# Altium schematic sheet Acquisition-System_V1.0_MCU.SchDoc: Acquisition-System
size A4; PageSetup: Record=PageOptions|CenterHorizontal=True|CenterVertical=True|PrintScale=0.97|XCorrection=1.00|YCorrection=1.00|PrintKind=0|BorderSize=5000000|LeftOffset=0|BottomOffset=0|Orientation=2|PaperLength=1000|PaperWidth=1000|Scale=100|PaperSource=7|PrintQuality=-3|MediaType=1|DitherType=10|PrintScaleMode=1|PaperKind=A4|PaperIndex=9; Organization: Ostschweizer Fachhochschule; Address2: Florian Baumgartner & Thierry Schwaller; Address3: florian.baumgartner@ost.ch; DocumentNumber: 4; Revision: V1.0; SheetNumber: 4; SheetTotal: 5; Author: Florian Baumgartner & Alain Keller; Subtitle: MCU
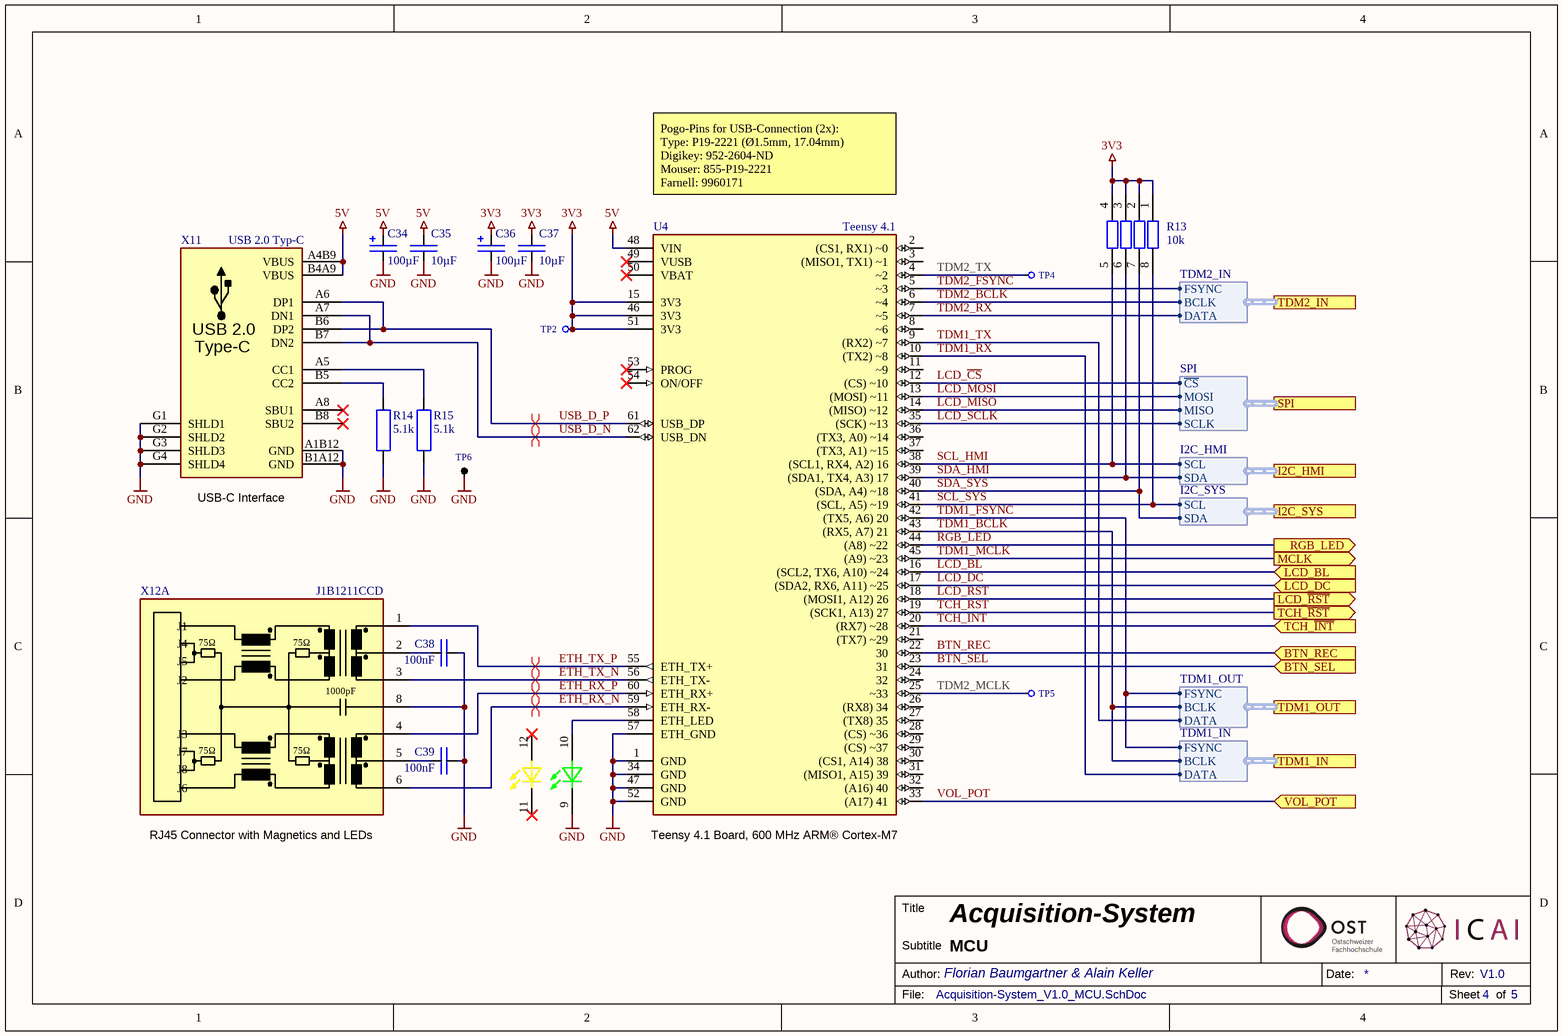
[diagram p0: Acquisition-System_V1.0_MCU.SchDoc]

## Parts
C34  100µF  [SMD Tantalkondensator 1210 +]
C35  10µF  [SMD Keramikkondensator 1206]
C36  100µF  [SMD Tantalkondensator 1210 +]
C37  10µF  [SMD Keramikkondensator 1206]
C38  100nF  [SMD Keramikkondensator 0603]
C39  100nF  [SMD Keramikkondensator 0603]
R13  10k  [SMD Widerstand Array 4-Fach 0603]
R14  5.1k  [SMD Widerstand 0603]
R15  5.1k  [SMD Widerstand 0603]
TP2  X-TP  [THT Testpunkt Ø1mm]  (value not drawn)  (no BOM)
TP4  X-TP  [THT Testpunkt Ø1mm]  (value not drawn)  (no BOM)
TP5  X-TP  [THT Testpunkt Ø1mm]  (value not drawn)  (no BOM)
TP6  Schwarz  [THT Messpunkt Ø2.54mm Schwarz]  (value not drawn)
U4  Teensy 4.1  [THT Teensy 4.1]
X11  USB 2.0 Typ-C  [SMD USB-C Socket (A40-00119)]
X12  J1B1211CCD  [THT RJ45 Socket (J1B1211CCD)]  (parts A,B of 2)

## Ports
BTN_REC (in), BTN_SEL (in), I2C_HMI (harness I2C_HMI), I2C_SYS (harness I2C_SYS), LCD_BL (in), LCD_DC (in), LCD_~{RST} (out), MCLK (out), RGB_LED (out), SPI (harness SPI), TCH_~{INT} (in), TCH_~{RST} (out), TDM1_IN (harness TDM1_IN), TDM1_OUT (harness TDM1_OUT), TDM2_IN (harness TDM2_IN), VOL_POT (in)

## Harnesses
I2C_HMI: SCL, SDA
TDM1_IN: BCLK, FSYNC, DATA
I2C_SYS: SCL, SDA
TDM2_IN: BCLK, FSYNC, DATA
TDM1_OUT: BCLK, FSYNC, DATA
SPI: SCLK, MOSI, ~{CS}, MISO

## Nets
3V3: C36.P(+) C37.2 R13.1 R13.2 R13.3 R13.4 TP2.1 U4.15(3V3) U4.46(3V3) U4.51(3V3)
5V: C34.P(+) C35.2 U4.48(VIN) X11.A4B9(VBUS) X11.B4A9(VBUS)
GND: C34.M(-) C35.1 C36.M(-) C37.1 C38.1 C39.1 R14.2 R15.2 TP6.1 U4.1(GND) U4.34(GND) U4.47(GND) U4.52(GND) U4.57(ETH_GND) X11.A1B12(GND) X11.B1A12(GND) X11.G1(SHLD1) X11.G2(SHLD2) X11.G3(SHLD3) X11.G4(SHLD4) X12.8(VC1-) X12.9(LEDYK)
BTN_REC: U4.22(30) ; port BTN_REC
BTN_SEL: U4.23(31) ; port BTN_SEL
ETH_RX_N: U4.59(ETH_RX-) X12.6(RD-)
ETH_RX_P: U4.60(ETH_RX+) X12.4(RD+)
ETH_TX_N: U4.56(ETH_TX-) X12.3(TD-)
ETH_TX_P: U4.55(ETH_TX+) X12.1(TD+)
LCD_BL: U4.16((SCL2,_TX6,_A10)_~24) ; port LCD_BL
LCD_~{CS}: U4.12((CS)_~10) ; port SPI.~{CS}
LCD_DC: U4.17((SDA2,_RX6,_A11)_~25) ; port LCD_DC
LCD_MISO: U4.14((MISO)_~12) ; port SPI.MISO
LCD_MOSI: U4.13((MOSI)_~11) ; port SPI.MOSI
LCD_~{RST}: U4.18((MOSI1,_A12)_26) ; port LCD_~{RST}
LCD_SCLK: U4.35((SCK)_~13) ; port SPI.SCLK
RGB_LED: U4.44((A8)_~22) ; port RGB_LED
SCL_HMI: R13.5 U4.38((SCL1,_RX4,_A2)_16) ; port I2C_HMI.SCL
SCL_SYS: R13.8 U4.41((SCL,_A5)_~19) ; port I2C_SYS.SCL
SDA_HMI: R13.6 U4.39((SDA1,_TX4,_A3)_17) ; port I2C_HMI.SDA
SDA_SYS: R13.7 U4.40((SDA,_A4)_~18) ; port I2C_SYS.SDA
TCH_~{INT}: U4.20((RX7)_~28) ; port TCH_~{INT}
TCH_~{RST}: U4.19((SCK1,_A13)_27) ; port TCH_~{RST}
TDM1_BCLK: U4.43((RX5,_A7)_21) ; port TDM1_IN.BCLK, port TDM1_OUT.BCLK
TDM1_FSYNC: U4.42((TX5,_A6)_20) ; port TDM1_IN.FSYNC, port TDM1_OUT.FSYNC
TDM1_MCLK: U4.45((A9)_~23) ; port MCLK
TDM1_RX: U4.10(NC) ; port TDM1_IN.DATA
TDM1_TX: U4.9(NC) ; port TDM1_OUT.DATA
TDM2_BCLK: U4.6(~4) ; port TDM2_IN.BCLK
TDM2_FSYNC: U4.5(~3) ; port TDM2_IN.FSYNC
TDM2_RX: U4.7(~5) ; port TDM2_IN.DATA
USB_D_N: U4.62(USB_DN) X11.A7(DN1) X11.B7(DN2)
USB_D_P: U4.61(USB_DP) X11.A6(DP1) X11.B6(DP2)
VOL_POT: U4.33((A17)_41) ; port VOL_POT
NetC38_2: C38.2 X12.2(TCT)
NetC39_2: C39.2 X12.5(RCT)
NetR14_1: R14.1 X11.B5(CC2)
NetR15_1: R15.1 X11.A5(CC1)
NetTP4_1: TP4.1 U4.4(~2)
NetTP5_1: TP5.1 U4.25(~33)
NetU4_58: U4.58(ETH_LED) X12.10(LEDYA)

Not connected (* = marked no-connect by the designer): U4 2((CS1,_RX1)_~0) 3((MISO1,_TX1)_~1) 8(~6) 11(NC) 21((TX7)_~29) 24(32) 26((RX8)_34) 27((TX8)_35) 28((CS)_~36) 29((CS)_~37) 30((CS1,_A14)_38) 31((MISO1,_A15)_39) 32((A16)_40) 36((TX3,_A0)_~14) 37((TX3,_A1)_~15) 49(VUSB)* 50(VBAT)* 53(PROG)* 54(ON/OFF)*; X11 A8(SBU1)* B8(SBU2)*; X12 7(NC) 11(LEDGK)* 12(LEDGA)*

## Layout directives
differential pair: ETH_RX_N, ETH_RX_P, ETH_TX_N, ETH_TX_P, USB_D_N, USB_D_P

## Notes on the sheet
- Pogo-Pins for USB-Connection (2x):
  Type: P19-2221 (Ø1.5mm, 17.04mm)
  Digikey: 952-2604-ND
  Mouser: 855-P19-2221
  Farnell: 9960171
- TDM2_TX
- (near X11) USB-C Interface
- TDM2_MCLK
- (near X12) RJ45 Connector with Magnetics and LEDs
- (near U4) Teensy 4.1 Board, 600 MHz ARM® Cortex-M7
- Title
- Author:
- Subtitle
- Date:
- Rev:
- File:
- Sheet
- of
- (in symbol X-J1B1211CCD, part A) J1; 75Ω; J4; J5; J2; 1000pF; J3; J7; J8; J6
- (in symbol X-USB-Buchse) USB 2.0; Type-C

## Library data of the parts
C34 C36 = C-ELCAP: CAP-Elko; Component Description: Tantalum Capacitor; Component Value: 100µF 6.3V; Digikey: 478-1677-1-ND; Farnell: 1135048; Mouser: 581-TAJB107K006R; JLC-Parts: C16133; Unit Price: 0.08
C35 C37 = E6 - 10uF: SMD Ceramic Capacitor E6; Component Value: 10µF 50V; Component Description: Multilayer Ceramic Capacitors MLCC; ComponentLink1Description: Datasheet; ComponentLink1URL: https://datasheet.lcsc.com/lcsc/1810191219_Samsung-Electro-Mechanics-CL10A106KP8NNNC_C19702.pdf; Digikey: 587-3258-1-ND; Farnell: 2113070; JLC-Parts: C13585; Mouser: 963-LMK107BBJ106MALT; Unit Price: 0.01
C38 C39 = E6 - 100nF: SMD Ceramic Capacitor E6; Component Value: 100nF 50V; Component Description: Multilayer Ceramic Capacitors MLCC; ComponentLink1Description: Datasheet; ComponentLink1URL: https://datasheet.lcsc.com/lcsc/1809301912_YAGEO-CC0603KRX7R9BB104_C14663.pdf; Digikey: 445-6899-1-ND; Farnell: 2210822; JLC-Parts: C14663; Mouser: 810-CGA2B3X7R1H104K; Unit Price: 0.01
R13 = R-Array Single Quad E24 - 10k: Isolated Resistor Array; Component Value: 10k (4x, 50V, 62.5mW, 5%); ComponentLink1Description: Datasheet; ComponentLink1URL: https://datasheet.lcsc.com/lcsc/1810191515_UNI-ROYAL-Uniroyal-Elec-4D03WGJ0103T5E_C29718.pdf; Digikey: Y4103CT-ND; Farnell: 2060167; JLC-Parts: C29718; Mouser: 667-EXB-V8V103JV; Unit Price: 0.01; Component Description: Isolated Resistor Array
R14 R15 = R-RESISTOR: RES (E=Heizwiderstand B=Messwandler); Component Description: Thick Film Chip Resistor; Component Value: 5.1k (75V, 100mW, 1%); Digikey: P5.10KHCT-ND; Farnell: 2059378; Mouser: 667-ERJ-3EKF5101V; JLC-Parts: C23186; Unit Price: 0.01
TP2 TP4 TP5 = X-TP: Testpunkt; Component Value: Ø 0.8mm; Component Description: Testpunkt; Unit Price: 0.00
TP6 = X-MP: Messpunkt; Component Description: Ground-Clip; Component Value: Ø 2.54mm (Black); Digikey: 36-5001-ND; Farnell: 2301278; Mouser: 534-5001; JLC-Parts: C238122; Unit Price: 0.36
U4 = U-Teensy-4.1: RT1062 i.MX ARM® Cortex®-M7 MPU; ComponentLink1Description: Datasheet; ComponentLink1URL: https://mm.digikey.com/Volume0/opasdata/d220001/medias/docus/497/DEV-16771_Web.pdf; Digikey: 1568-DEV-16771-ND; Component Value: Teensy 4.1; Mouser: 474-DEV-16771; Unit Price: 28.70; Component Description: RT1062 i.MX ARM® Cortex®-M7 MPU
X11 = X-USB-Buchse: Typ-C; aliExpress: 33045191307; Component Description: USB Connector Type-C; Component Value: USB4105-GF-A; Digikey: 2073-USB4105-GF-ACT-ND; Farnell: 3583366; ComponentLink1Description: Datasheet; ComponentLink1URL: https://datasheet.lcsc.com/lcsc/2103051833_Jing-Extension-of-the-Electronic-Co--918-418K2023S40001_C167321.pdf; JLC-Parts: C167321; Unit Price: 0.34
X12 = X-J1B1211CCD: RJ45 Connector with Magnetics and LEDs; DigiKey: 1278-1052-ND; Mouser: 950-J1B1211CCD; Component Description: RJ45 Connector with Magnetics and LEDs; Component Value: J1B1211CCD; JLC-Parts: C910371; Unit Price: 1.85; ComponentLink2Description: Datasheet; ComponentLink2URL: https://datasheet.lcsc.com/lcsc/2011180207_WIZNET-J1B1211CCD_C910371.pdf